# EAGLE design untitled (EAGLE 7.7.0)
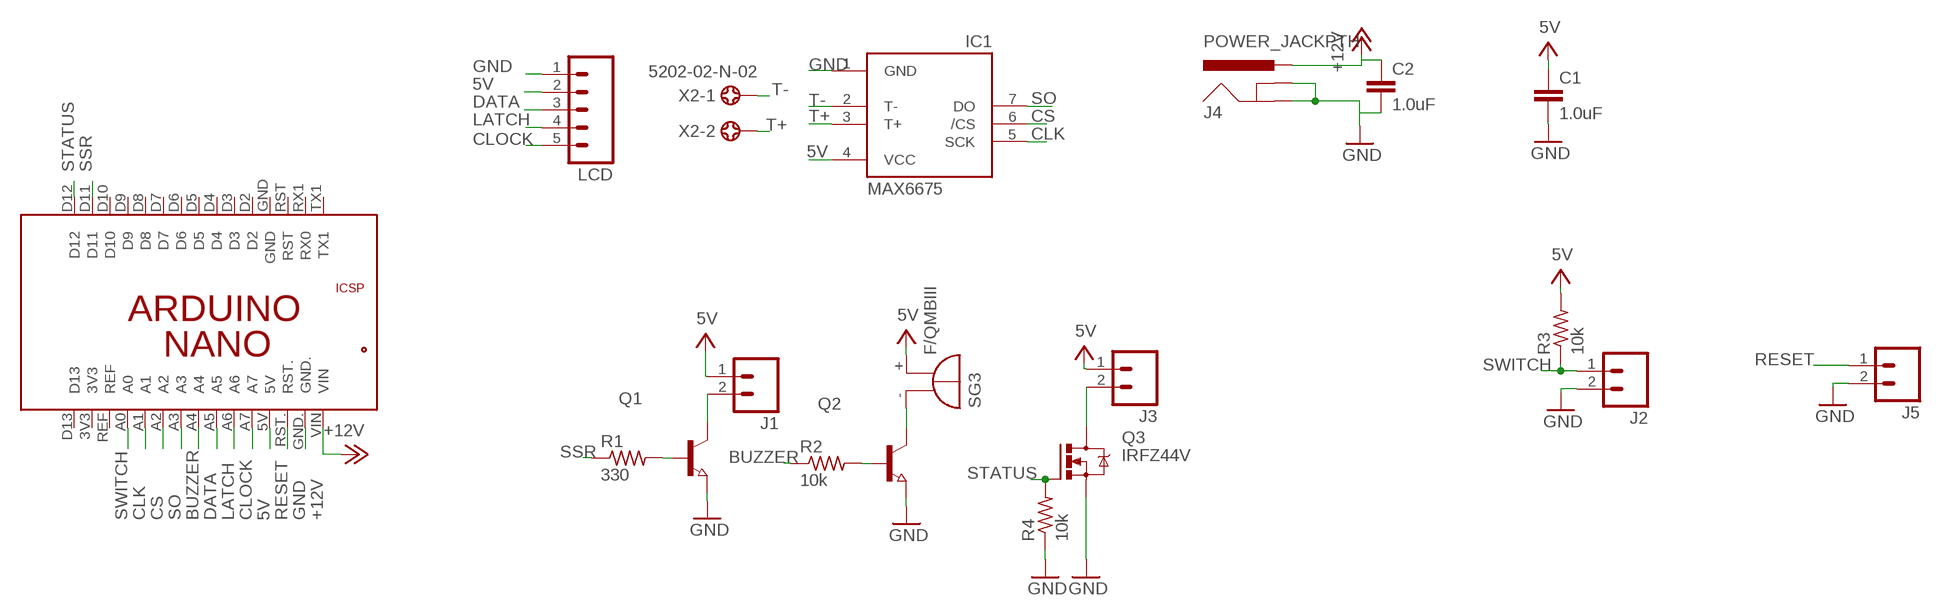
[diagram p0: schematic, sheet 1]

## Parts
C1  1.0uF  1.0UF50V10%(1206)  [1206-CAP]
C2  1.0uF  1.0UF50V10%(1206)  [1206-CAP]
IC1  MAX6675  [SO08]
J1  M02PTH  [1X02]
J2  M02PTH  [1X02]
J3  M02PTH  [1X02]
J4  POWER_JACKPTH  [POWER_JACK_PTH]
J5  M02PTH  [1X02]
LCD  M05PTH  [1X05]
PCB2  ARDUINO_NANO_RHEYD  [ARDUINO_NANO]
Q1  NPN-TRANSISTOR_SOT23  [SOT23]
Q2  NPN-TRANSISTOR_SOT23  [SOT23]
Q3  IRFZ44V  IRFZ48Z  [TO220BH]
R1  330  R-US_R1206  [R1206]
R2  10k  R-US_R1206  [R1206]
R3  10k  R-US_R1206  [R1206]
R4  10k  R-US_R1206  [R1206]
SG3  F/QMBIII  [F/QMBIII]
X2  5202-02-N-02  [5202-02-N-02]

## Nets
5V: C1.1 IC1.4(VCC) J1.1 J3.1 LCD.2 PCB2.5V R3.2 SG3.+(-)
+12V: C2.1 J4.PWR PCB2.VIN
BUZZER: PCB2.A4 R2.1
CLK: IC1.5(SCK) PCB2.A1
CLOCK: LCD.5 PCB2.A7
CS: IC1.6(/CS) PCB2.A2
DATA: LCD.3 PCB2.A5
GND: C1.2 C2.2 IC1.1(GND) J2.2 J4.GND J4.GNDBREAK J5.2 LCD.1 PCB2.GND. Q1.2(E) Q2.2(E) Q3.S R4.1
LATCH: LCD.4 PCB2.A6
N$1: Q1.1(B) R1.2
N$2: Q2.1(B) R2.2
N$4: Q2.3(C) SG3.-(+)
N$5: J1.2 Q1.3(C)
N$6: J3.2 Q3.D
RESET: J5.1 PCB2.RST.
SO: IC1.7(DO) PCB2.A3
SSR: PCB2.D11 R1.1
STATUS: PCB2.D12 Q3.G R4.2
SWITCH: J2.1 PCB2.A0 R3.1
T+: IC1.3(T+) X2.2
T-: IC1.2(T-) X2.1
Unconnected: PCB2.3V3 PCB2.D2 PCB2.D3 PCB2.D4 PCB2.D5 PCB2.D6 PCB2.D7 PCB2.D8 PCB2.D9 PCB2.D10 PCB2.D13 PCB2.GND PCB2.REF PCB2.RST PCB2.RX1(RX0) PCB2.TX1

## Library data of the parts
C1 C2 = SparkFun-Capacitors:1.0UF50V10%(1206): CAP-09822; PROD_ID: CAP-09822
IC1 = adafruit:MAX6675
J1-J3 J5 = SparkFun-Connectors:M02: Standard 2-pin 0.1" header. Use with - straight break away headers ( PRT-00116) - right angle break away headers (PRT-00553) - swiss pins (PRT-00743) - machine pins (PRT-00117) - female headers (PRT-00115) Molex polarized connector foot print use with: PRT-08233 with associated crimp pins and housings. 2.54_SCREWTERM for use with PRT-10571. 3.5mm Screw Terminal footprints for PRT-08084 5mm Screw Terminal footprints for use with PRT-08432
J4 = SparkFun-Connectors:POWER_JACK: Power Jack This is the standard 5.5mm barrel jack for power. The PTH is the most common, proven, reliable, footprint. The Slot footprint only works if the mill layer is transmitted to the PCB fab house so be warned. Mating wall wart : TOL-00298 (and others); PROD_ID: CONN-08197
LCD = SparkFun-Connectors:M05: Header 5 Standard 5-pin 0.1" header. Use with straight break away headers (SKU : PRT-00116), right angle break away headers (PRT-00553), swiss pins (PRT-00743), machine pins (PRT-00117), and female headers (PRT-00115). Molex polarized connector foot print use with SKU : PRT-08230 with associated crimp pins and housings.
PCB2 = E14_Arduino_revB:ARDUINO_NANO_RHEYD: Device for representing an Arduino Nano board with a footprint in an EAGLE design. Created by Dave Young for Element14. More EAGLE documentation at: http://www.element14.com/community/community/knode/cadsoft_eagle
Q1 Q2 = semicon-smd-ipc:NPN-TRANSISTOR_: NPN TRANSISTOR
Q3 = transistor-power:IRFZ48: N Channel HEXFET® Power MOSFET Logic Level Source: http://www.irf.com/product-info/datasheets/data/irfz48z.pdf
R1-R4 = adafruit:R-US_: RESISTOR, American symbol
SG3 = buzzer:F/QMBIII: BUZZER Source: Buerklin; OC_FARNELL: unknown; OC_NEWARK: unknown
X2 = con-ebyelectro:5202-02-N-02: Barrier Blocks Sreies 5202 Source: http://www.ebyelectro.com/PDF/5202-XX-N-02.pdf

## Board
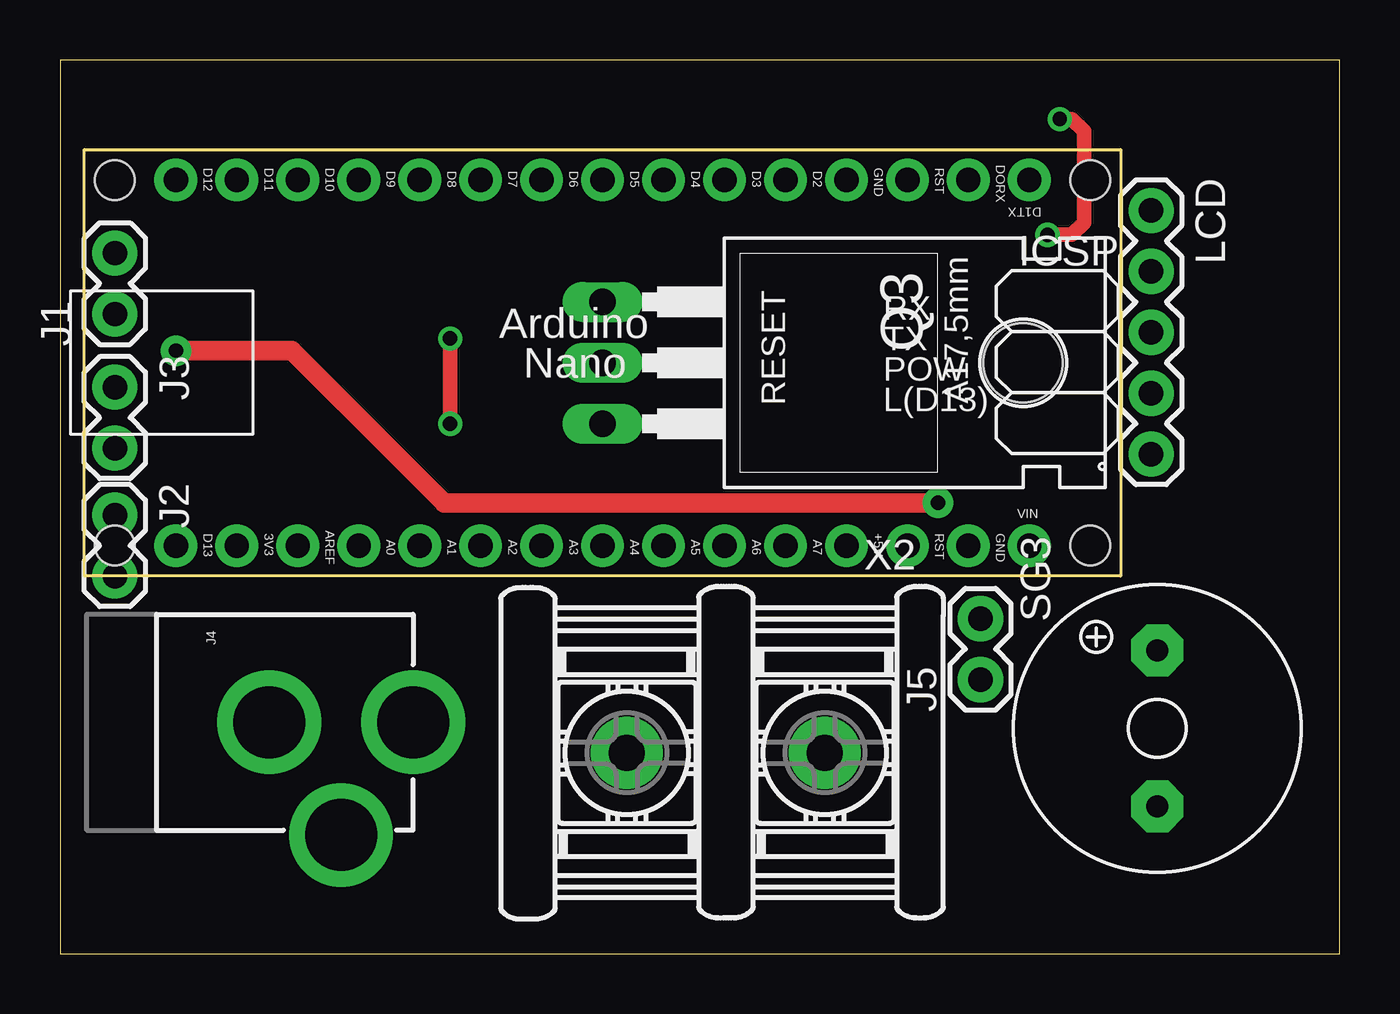
[diagram p1: board, top side]
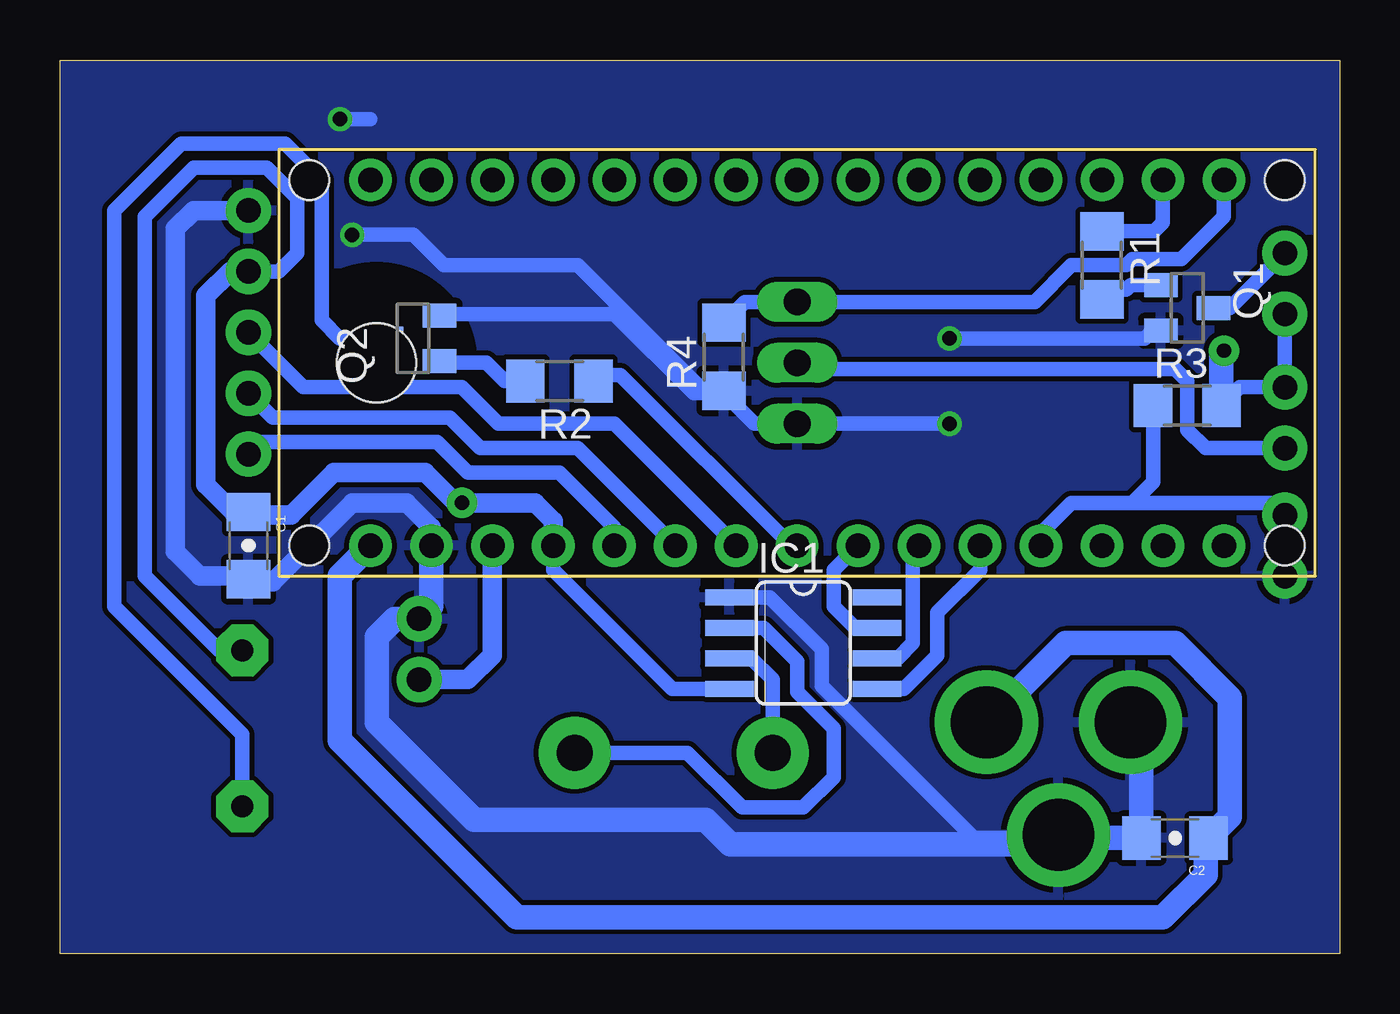
[diagram p2: board, bottom side, seen from below]

Size 53.32 x 37.26 mm. Coordinates in mm from the lower left corner, seen from the top.
Outline: 0,0 53.32,0 53.32,37.26 0,37.26 0,0
Copper layers (1*16): Top 0.035mm / dielectric 1.5mm / Bottom 0.035mm
Design rules "default *": minimum track width 10mil, minimum drill 24mil, track to track 8mil, track to pad 8mil, pad to pad 8mil, via to via 8mil, smd to smd 8mil, copper to edge 1mil, drill to drill 8mil, minimum pad ring 10mil, minimum via ring 8mil, stop-mask expansion 4mil, vias tented up to drill 0mil, thermal gap 10mil

### Footprints (pad centres in the part's own frame; a part is rotated, then mirrored left to right if it is on the bottom)
1206-CAP = smd 1.6 x 1.8: 1 -1.4,0; 2 1.4,0
SO08 = smd 0.66 x 2.032: 1 -1.905,-3.073; 2 -0.635,-3.073; 3 0.635,-3.073; 4 1.905,-3.073; 5 1.905,3.073; 6 0.635,3.073; 7 -0.635,3.073; 8 -1.905,3.073
1X02 = drill 1.016 pad 1.88: 1 0,0; 2 2.54,0
POWER_JACK_PTH = drill 2.997 pad 4.318: GND 0,7.7; GNDBREAK 4.7,10.7; PWR 0,13.7
1X05 = drill 1.016 pad 1.88: 1 0,0; 2 2.54,0; 3 5.08,0; 4 7.62,0; 5 10.16,0
ARDUINO_NANO = drill 1.016 pad 1.778: 3V3 6.35,1.27; 5V 31.75,1.27; A0 11.43,1.27; A1 13.97,1.27; A2 16.51,1.27; A3 19.05,1.27; A4 21.59,1.27; A5 24.13,1.27; A6 26.67,1.27; A7 29.21,1.27; D2 29.21,16.51; D3 26.67,16.51; D4 24.13,16.51; D5 21.59,16.51; D6 19.05,16.51; D7 16.51,16.51; D8 13.97,16.51; D9 11.43,16.51; D10 8.89,16.51; D11 6.35,16.51; D12 3.81,16.51; D13 3.81,1.27; GND 31.75,16.51; GND. 36.83,1.27; REF 8.89,1.27; RST 34.29,16.51; RST. 34.29,1.27; RX1 36.83,16.51; TX1 39.37,16.51; VIN 39.37,1.27 | hole 1.651: 1.27,1.27; 1.27,16.51; 41.91,16.51; 41.91,1.27
SOT23 = smd 1 x 1.4: 1 -0.95,-1.1; 2 0.95,-1.1; 3 0,1.1
TO220BH = drill 1.118 long: D 0,-6.35; G -2.54,-6.35; S 2.54,-6.35 | hole 3.302: 0,11.176
R1206 = smd 1.6 x 1.803: 1 -1.422,0; 2 1.422,0
F/QMBIII = drill 0.914 pad 2.159 octagon: + 3.251,0; - -3.251,0
5202-02-N-02 = drill 1.5 pad 3: 1 -8.25,0; 2 0,0

### Placement (x,y rotation side)
C1  45.47,17.02 270 bottom
C2  6.86,4.83 180 bottom
IC1  22.35,12.95 270 bottom
J1  2.29,26.67 90 top
J2  2.29,18.29 270 top
J3  2.29,23.62 270 top
J4  1.02,9.65 270 top
J5  38.35,11.43 90 top
LCD  45.47,30.99 270 top
PCB2  1.02,15.75 0 top
Q1  6.35,26.92 270 bottom
Q2  38.61,25.65 90 bottom
Q3  28.96,24.64 270 top
R1  9.91,28.7 270 bottom
R2  32.51,23.88 180 bottom
R3  6.35,22.86 0 bottom
R4  25.65,24.89 90 bottom
SG3  45.72,9.4 90 top
X2  23.62,8.38 180 top

### Tracks (layer width: path | path; a pad name or v marks a point on that pad's centre or on a via)
5V  (via drill 0.6 pad 1.27)
  Top 0.813: v4.83,25.15 9.65,25.15 16,18.8 v36.58,18.8
  Bottom 0.61: PCB2.5V 32.77,16 27.81,11.05 IC1.4 | J1.1 J3.1 4.17,23.62 R3.2 | 45.84,28.32 45.97,28.45 | SG3.+ 46.69,12.65 49.78,15.75 49.78,30.73 47.75,32.77 44.7,32.77 43.43,31.5 43.43,29.21 44.2,28.45 LCD.2
  Bottom 0.813: PCB2.5V 32.77,18.03 33.53,18.8 v36.58,18.8 36.83,18.8 38.1,20.07 41.91,20.07 43.69,18.29 45.34,18.29 C1.1 46.1,18.42 47.24,19.56 47.24,27.43 46.23,28.45 45.97,28.45 LCD.2
  Bottom 1.016: R3.2 4.93,25.04 v4.83,25.15
+12V
  Bottom 1.016: J4.PWR 11.41,12.95 6.86,12.95 4.57,10.67 4.57,5.71 C2.1 5.59,4.7 5.59,3.3 7.37,1.52 34.29,1.52 41.66,8.89 41.66,15.75 PCB2.VIN
BUZZER
  Bottom 0.61: PCB2.A4 22.86,17.02 29.97,24.13 30.84,24.13 R2.1
CLK
  Bottom 0.61: IC1.5 18.16,11.05 16.76,12.45 16.76,14.22 14.99,16 PCB2.A1
CLOCK
  Bottom 0.61: PCB2.A7 30.23,17.78 32.51,20.07 36.32,20.07 37.59,21.34 44.96,21.34 LCD.5
CS
  Bottom 0.61: IC1.6 18.41,12.32 17.78,12.95 17.78,16.76 PCB2.A2
DATA
  Bottom 0.61: PCB2.A5 30.23,22.1 35.05,22.1 36.58,23.62 43.18,23.62 LCD.3
GND  (via drill 0.6)
  Top 0.61: v16.26,25.65 v16.26,22.1 | v41.15,29.97 42.16,29.97 42.67,30.48 42.67,34.29 42.16,34.8 v41.66,34.8
  Bottom 0.61: IC1.1 23.75,14.86 21.59,12.7 21.59,11.18 15.24,4.83 11.84,4.83 J4.GNDBREAK 10.8,4.95 | 8.64,9.57 J4.GND | 45.34,31.12 LCD.1 | Q1.2 7.81,25.97 8.13,25.65 v16.26,25.65 | v16.26,22.1 Q3.S 24.38,22.1 25.65,23.37 26.42,23.37 | 26.42,23.37 26.92,23.37 30.23,26.67 37.44,26.67 Q2.2 | 26.42,23.37 31.75,28.7 37.34,28.7 38.61,29.97 v41.15,29.97 | v41.66,34.8 40.39,34.8
  Bottom 0.813: PCB2.GND. 37.85,17.78 38.86,18.8 41.15,18.8 44.45,15.49 45.34,15.49 C1.2 45.6,15.75 47.5,15.75 48.51,16.76 48.51,30.23 47.75,30.99 LCD.1
  Bottom 1.016: 12.19,4.57 25.4,4.57 26.42,5.59 36.07,5.59 40.13,9.65 40.13,13.21 39.37,13.97 J5.2 37.85,14.48 PCB2.GND. | 12.19,4.57 12.1,4.57 J4.GNDBREAK | 12.19,4.57 11.94,4.83 C2.2 8.26,9.19 J4.GND
  pour Bottom: -1.78,-1.52 54.61,-1.52 54.61,38.61 -1.78,38.61
LATCH
  Bottom 0.61: PCB2.A6 31.75,21.08 35.81,21.08 37.08,22.35 44.45,22.35 LCD.4
N$1
  Bottom 0.61: Q1.1 8.7,27.87 8.89,27.69 9.5,27.69 R1.2
N$2
  Bottom 0.61: R2.2 34.8,23.88 35.56,24.64 37.44,24.64 Q2.1
N$4
  Bottom 0.61: Q2.3 41.66,25.65 42.42,26.42 42.42,32.26 43.94,33.78 48.26,33.78 51.05,30.99 51.05,14.48 45.72,9.14 SG3.-
N$5
  Bottom 0.61: J1.2 4.57,26.92 Q1.3
N$6
  Bottom 0.61: J3.2 5.59,21.08 6.35,21.84 6.35,23.88 6.86,24.38 22.35,24.38 Q3.D
RESET
  Bottom 0.813: J5.1 36.32,11.43 35.31,12.45 PCB2.RST.
SO
  Bottom 0.61: IC1.7 20.19,13.59 21.08,14.48 21.08,16 PCB2.A3
SSR
  Bottom 0.61: R1.1 7.72,30.12 7.37,30.48 PCB2.D11
STATUS
  Bottom 0.61: R4.2 24.79,27.18 23.11,27.18 Q3.G 12.7,27.18 11.18,28.7 8.89,28.7 8.64,28.96 6.6,28.96 4.83,30.73 PCB2.D12
SWITCH
  Bottom 0.61: R3.1 7.77,19.66 8.64,18.8 | 8.64,18.8 9.14,18.8 11.18,18.8 12.45,17.53 PCB2.A0 | J2.1 2.79,18.8 8.64,18.8
T+
  Bottom 0.61: X2.2 23.62,11.43 24.51,12.32 IC1.3
T-
  Bottom 0.61: X2.1 27.18,8.38 24.89,6.1 22.35,6.1 21.08,7.37 21.08,9.4 22.61,10.92 22.61,12.19 24,13.59 IC1.2